# Altium project F_keys.PrjPcb
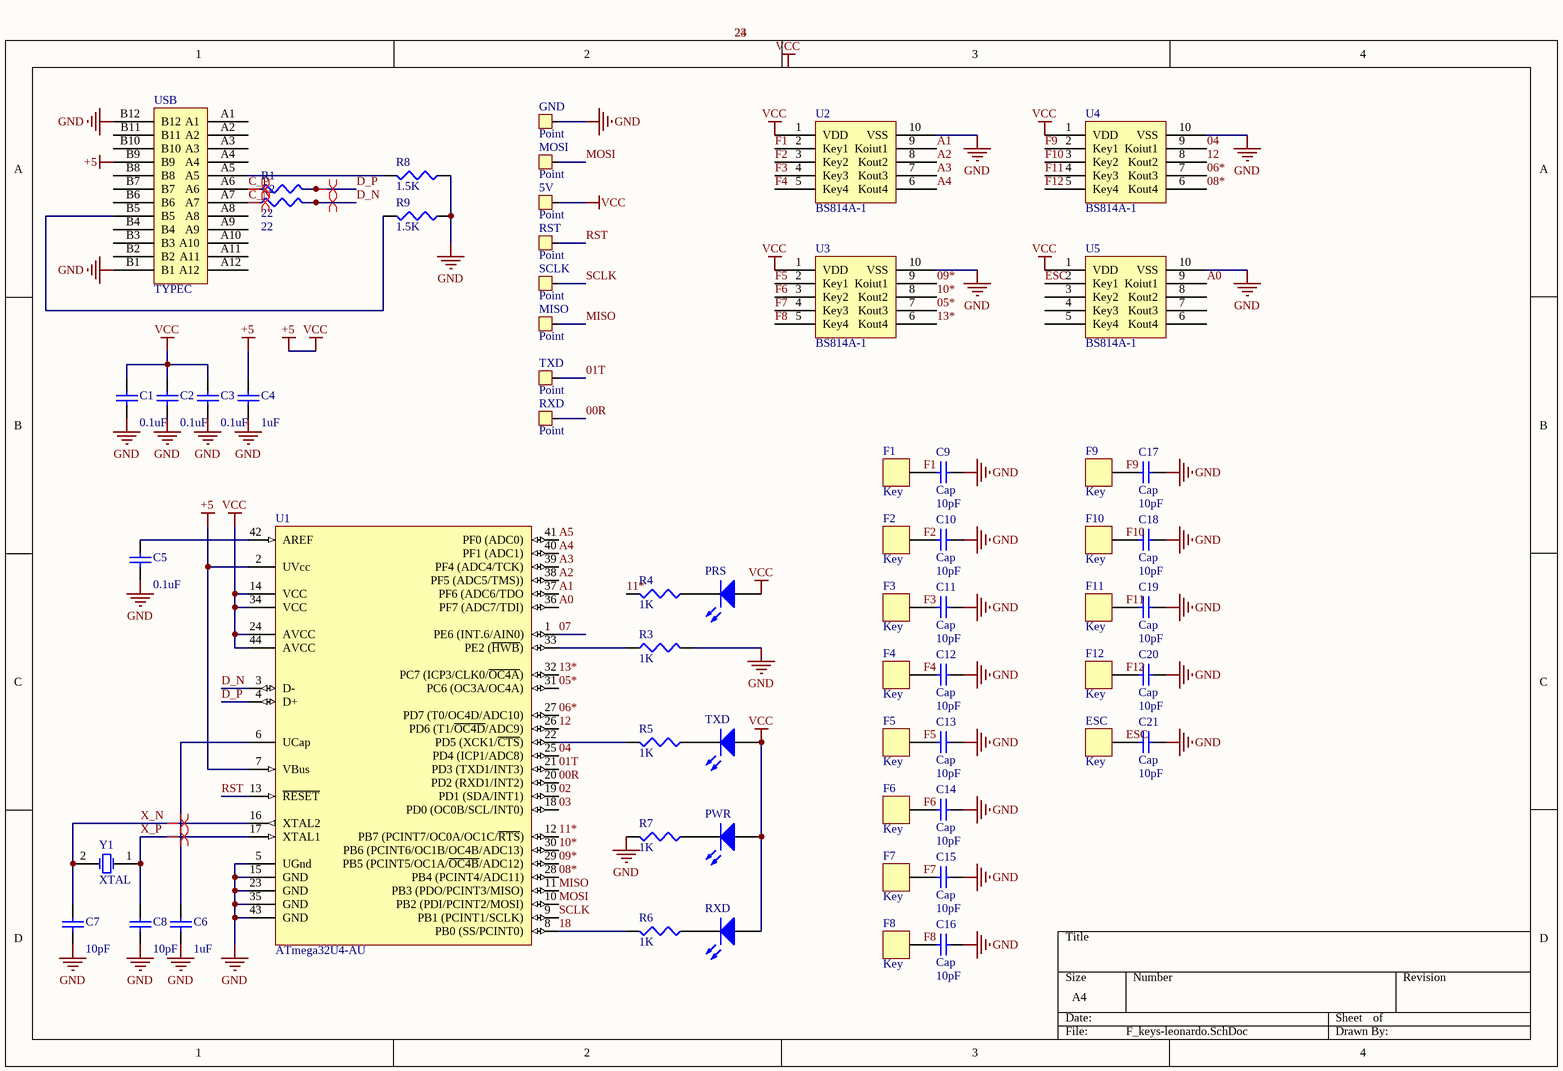
[diagram p0: F_keys-leonardo.SchDoc]
1 sheet, 62 parts. Net scope: global (net labels, ports and power ports of the same name join across sheets).
Board file: F_keys-leonardo.PcbDoc

## Sheet F_keys-leonardo.SchDoc
size A4; SheetNumber: 1; SheetTotal: 1

### Parts
(Parts that share a designator on the sheet are numbered #1, #2 ... from top to bottom, then left to right.)
5V  Point  [Point]
C1  value 0.1uF  [0603P]  (hidden comment: Cap)
C2  value 0.1uF  [0603P]  (hidden comment: Cap)
C3  value 0.1uF  [0603P]  (hidden comment: Cap)
C4  value 1uF  [0603P]  (hidden comment: Cap)
C5  value 0.1uF  [0603P]  (hidden comment: Cap)
C6  value 1uF  [0603P]  (hidden comment: Cap)
C7  value 10pF  [0603P]  (hidden comment: Cap)
C8  value 10pF  [0603P]  (hidden comment: Cap)
C9  Cap  value 10pF  [0603P]
C10  Cap  value 10pF  [0603P]
C11  Cap  value 10pF  [0603P]
C12  Cap  value 10pF  [0603P]
C13  Cap  value 10pF  [0603P]
C14  Cap  value 10pF  [0603P]
C15  Cap  value 10pF  [0603P]
C16  Cap  value 10pF  [0603P]
C17  Cap  value 10pF  [0603P]
C18  Cap  value 10pF  [0603P]
C19  Cap  value 10pF  [0603P]
C20  Cap  value 10pF  [0603P]
C21  Cap  value 10pF  [0603P]
ESC  Key  [Key]
F1  Key  [Key]
F2  Key  [Key]
F3  Key  [Key]
F4  Key  [Key]
F5  Key  [Key]
F6  Key  [Key]
F7  Key  [Key]
F8  Key  [Key]
F9  Key  [Key]
F10  Key  [Key]
F11  Key  [Key]
F12  Key  [Key]
GND  Point  [Point]
MISO  Point  [Point]
MOSI  Point  [Point]
PRS  LED0  [D0603]  (value not drawn)
PWR  LED0  [D0603]  (value not drawn)
R1  value 22  [0603L]  (hidden comment: Res3)
R2  value 22  [0603L]  (hidden comment: Res3)
R3  value 1K  [0603L]  (hidden comment: Res3)
R4  value 1K  [0603L]  (hidden comment: Res3)
R5  value 1K  [0603L]  (hidden comment: Res3)
R6  value 1K  [0603L]  (hidden comment: Res3)
R7  value 1K  [0603L]  (hidden comment: Res3)
R8  value 1.5K  [0603L]  (hidden comment: Res3)
R9  value 1.5K  [0603L]  (hidden comment: Res3)
RST  Point  [Point]
RXD#1  Point  [Point]
RXD#2  LED0  [D0603]  (value not drawn)
SCLK  Point  [Point]
TXD#1  Point  [Point]
TXD#2  LED0  [D0603]  (value not drawn)
U1  ATmega32U4-AU  [32U4]
U2  BS814A-1  [BS814A-1]
U3  BS814A-1  [BS814A-1]
U4  BS814A-1  [BS814A-1]
U5  BS814A-1  [BS814A-1]
USB  TYPEC  [typec]
Y1  XTAL  [3225]

### Nets
+5: 5V.1 C1.2 C2.2 C3.2 C4.2 PRS.1(A) PWR.1(A) RXD#2.1(A) TXD#2.1(A) U1.2(UVcc) U1.7(VBus) U1.14(VCC) U1.24(AVCC) U1.34(VCC) U1.44(AVCC) U2.1(VDD) U3.1(VDD) U4.1(VDD) U5.1(VDD) USB.B9  [also labelled VCC]
GND: C1.1 C2.1 C3.1 C4.1 C5.1 C6.2 C7.1 C8.1 C9.2 C10.2 C11.2 C12.2 C13.2 C14.2 C15.2 C16.2 C17.2 C18.2 C19.2 C20.2 C21.2 GND.1 R3.2 R7.2 R8.1 R9.1 U1.5(UGnd) U1.15(GND) U1.23(GND) U1.35(GND) U1.43(GND) U2.10(VSS) U3.10(VSS) U4.10(VSS) U5.10(VSS) USB.B1 USB.B12
00R: RXD#1.1 U1.20(PD2_(RXD1/INT2))
01T: TXD#1.1 U1.21(PD3_(TXD1/INT3))
02: U1.19(PD1_(SDA/INT1))
03: U1.18(PD0_(OC0B/SCL/INT0))
04: U1.25(PD4_(ICP1/ADC8)) U4.9(Koiut1)
05*: U1.31(PC6_(OC3A/OC4A)) U3.7(Kout3)
06*: U1.27(PD7_(T0/OC4D/ADC10)) U4.7(Kout3)
07: U1.1(PE6_(INT.6/AIN0))
08*: U1.28(PB4_(PCINT4/ADC11)) U4.6(Kout4)
09*: U1.29(PB5_(PCINT5/OC1A/~{OC4B}/ADC12)) U3.9(Koiut1)
10*: U1.30(PB6_(PCINT6/OC1B/OC4B/ADC13)) U3.8(Kout2)
11*: R4.2 U1.12(PB7_(PCINT7/OC0A/OC1C/~{RTS}))
12: U1.26(PD6_(T1/~{OC4D}/ADC9)) U4.8(Kout2)
13*: U1.32(PC7_(ICP3/CLK0/~{OC4A})) U3.6(Kout4)
18: R6.2 U1.8(PB0_(SS/PCINT0))
A0: U1.36(PF7_(ADC7/TDI)) U5.9(Koiut1)
A1: U1.37(PF6_(ADC6/TDO) U2.9(Koiut1)
A2: U1.38(PF5_(ADC5/TMS))) U2.8(Kout2)
A3: U1.39(PF4_(ADC4/TCK)) U2.7(Kout3)
A4: U1.40(PF1_(ADC1)) U2.6(Kout4)
A5: U1.41(PF0_(ADC0))
C_N: R2.1 USB.A7
C_P: R1.1 USB.A6
D_N: R2.2 U1.3(D-)
D_P: R1.2 U1.4(D+)
ESC: C21.1 ESC.1 U5.2(Key1)
F1: C9.1 F1.1 U2.2(Key1)
F2: C10.1 F2.1 U2.3(Key2)
F3: C11.1 F3.1 U2.4(Key3)
F4: C12.1 F4.1 U2.5(Key4)
F5: C13.1 F5.1 U3.2(Key1)
F6: C14.1 F6.1 U3.3(Key2)
F7: C15.1 F7.1 U3.4(Key3)
F8: C16.1 F8.1 U3.5(Key4)
F9: C17.1 F9.1 U4.2(Key1)
F10: C18.1 F10.1 U4.3(Key2)
F11: C19.1 F11.1 U4.4(Key3)
F12: C20.1 F12.1 U4.5(Key4)
MISO: MISO.1 U1.11(PB3_(PDO/PCINT3/MISO))
MOSI: MOSI.1 U1.10(PB2_(PDI/PCINT2/MOSI))
RST: RST.1 U1.13(~{RESET})
SCLK: SCLK.1 U1.9(PB1_(PCINT1/SCLK))
X_N: C7.2 U1.16(XTAL2) Y1.2(OSC2)
X_P: C8.2 U1.17(XTAL1) Y1.1(OSC1)
NetC5_2: C5.2 U1.42(AREF)
NetC6_1: C6.1 U1.6(UCap)
NetPRS_2: PRS.2(K) R4.1
NetPWR_2: PWR.2(K) R7.1
NetR3_1: R3.1 U1.33(PE2_(~{HWB}))
NetR5_1: R5.1 TXD#2.2(K)
NetR5_2: R5.2 U1.22(PD5_(XCK1/~{CTS}))
NetR6_1: R6.1 RXD#2.2(K)
NetR8_2: R8.2 USB.A5
NetR9_2: R9.2 USB.B5

Not connected (* = marked no-connect by the designer): U5 3(Key2) 4(Key3) 5(Key4) 6(Kout4) 7(Kout3) 8(Kout2); USB A1 A2 A3 A4 A8 A9 A10 A11 A12 B2 B3 B4 B6 B7 B8 B10 B11

### Layout directives
differential pair: C_N, C_P, D_N, D_P, X_N, X_P

### Notes on the sheet
- Labels drawn without touching a wire or pin: VCC

### Library data of the parts
C1-C21 = Cap: Capacitor; Published: 8-Jun-2000; LatestRevisionDate: 17-Jul-2002; LatestRevisionNote: Re-released for DXP Platform.; PackageReference: RAD-0.3; Publisher: Altium Limited; PackageDescription: Radial Cap, Thru-Hole; 2 Leads; 0.3 in Pin Spacing
PRS PWR RXD#2 TXD#2 = LED0: Typical INFRARED GaAs LED; Published: 8-Jun-2000; LatestRevisionDate: 08-Jul-2005; LatestRevisionNote: Mech Layer 1 removed.; PackageReference: LED-0; Publisher: Altium Limited; PackageDescription: LED; 2 Leads
R1-R9 = Res3: Resistor; Published: 8-Jun-2000; LatestRevisionDate: 29-May-2009; LatestRevisionNote: IPC-7351 Footprint Added.; PackageReference: J1-0603; Publisher: Altium Limited; PackageDescription: Chip Resistor
U1 = ATmega32U4-AU: 8-bit AVR Microcontroller, 2.7-5.5V, 32KB Flash, 2.5KB EEPROM, 1KB SRAM, USB Controller, 44-pin TQFP, Industrial Grade (-40癈 to 85癈); Published: 1-Apr-2010; DatasheetVersion: revD, Jan-2009; PackageVersion: rev.G, Jul-2007; PackageReference: 44ML; Publisher: Altium Limited; PackageDescription: 44-Pin Plastic Thin Quad Flat Pack, 10 x 10 x 1.0 mm Body, 0.8 mm Pitch (TQFP); Supplier 1: Digi-Key; Supplier Part Number 1: ATMEGA32U4-AU-ND; Supplier 2: Farnell; Supplier Part Number 2: 1748525; Supplier 3: Mouser; Supplier Part Number 3: 556-ATMEGA32U4-AU; ComponentLink1Description: Manufacturer Link; ComponentLink1URL: http://www.atmel.com/products/avr/default.asp?; ComponentLink2Description: ATmega16U4/32U4 Datasheet; ComponentLink2URL: http://www.atmel.com/dyn/resources/prod_documents/doc7766.pdf; ComponentLink3Description: ATmega16U4 ATmega32U4 Summary; ComponentLink3URL: http://www.atmel.com/dyn/resources/prod_documents/7766S.pdf; ComponentLink4Description: Atmel.com Home; ComponentLink4URL: http://www.atmel.com
Y1 = XTAL: Crystal Oscillator; Published: 8-Jun-2000; LatestRevisionDate: 17-Jul-2002; LatestRevisionNote: Re-released for DXP Platform.; PackageReference: R38; Publisher: Altium Limited; PackageDescription: Crystal, Thru-Hole; 2 Leads; Body 3.1 x 8.2 mm (Dia.xH)